# EAGLE design caphumidsens2_rev1_rc2 (EAGLE 6.3)
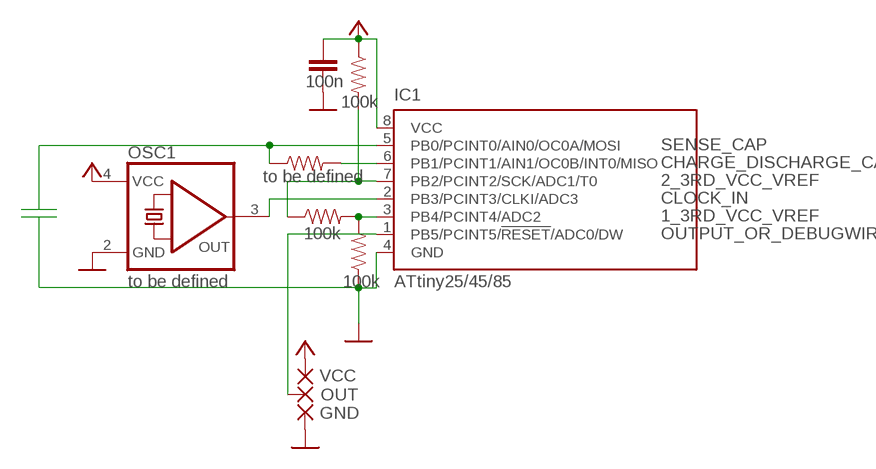
[diagram p0: schematic, sheet 1]

## Parts
C1  100n  CAP0805  [0805]
GND  WIREPADSMD2,54-5,08  SMD2  [SMD1,27-2,54]
IC1  ATtiny25/45/85  TINY13V-10SSU  [8S1]
OSC1  to be defined  XO32-OSCILLATOR  [XO32]
OUT  WIREPADSMD2,54-5,08  SMD2  [SMD1,27-2,54]
R1  100k  RESISTOR0805-RES  [0805]
R2  100k  RESISTOR0805-RES  [0805]
R3  100k  RESISTOR0805-RES  [0805]
R4  to be defined  RESISTOR0805-RES  [0805]
VCC  WIREPADSMD2,54-5,08  SMD2  [SMD1,27-2,54]

## Nets
1_3RD_VCC_VREF: IC1.3(PB4/PCINT4/ADC2) R2.2 R3.2
2_3RD_VCC_VREF: IC1.7(PB2/PCINT2/SCK/ADC1/T0) R1.2 R2.1
CHARGE_DISCHARGE_CAP: IC1.6(PB1/PCINT1/AIN1/OC0B/INT0/MISO) R4.2
CLOCK_IN: IC1.2(PB3/PCINT3/CLKI/ADC3) OSC1.3(OUT)
GND: C1.1 GND.1(P) IC1.4(GND) OSC1.2(GND) R3.1
OUTPUT_OR_DEBUGWIRE: IC1.1(PB5/PCINT5/!RESET!/ADC0/DW) OUT.1(P)
SENSE_CAP: IC1.5(PB0/PCINT0/AIN0/OC0A/MOSI) R4.1
VCC: C1.2 IC1.8(VCC) OSC1.4(VCC) R1.1 VCC.1(P)

## Library data of the parts
C1 = SparkFun:CAP: Capacitor Standard 0603 ceramic capacitor, and 0.1" leaded capacitor.
GND OUT VCC = wirepad:SMD2: SMD PAD
IC1 = atmel:TINY13: 8-bit AVR Microcontroller with 1K Bytes In-System Programmable Flash Source: http://www.atmel.com/dyn/resources/prod_documents/2535S.pdf; MPN: ATTINY13V-10SSU; OC_FARNELL: 1455135; OC_NEWARK: 58M3773
OSC1 = seb:XO32-OSCILLATOR
R1-R4 = SparkFun:RESISTOR: Resistor Basic schematic elements and footprints for 0603, 1206, and PTH resistors.

## Board
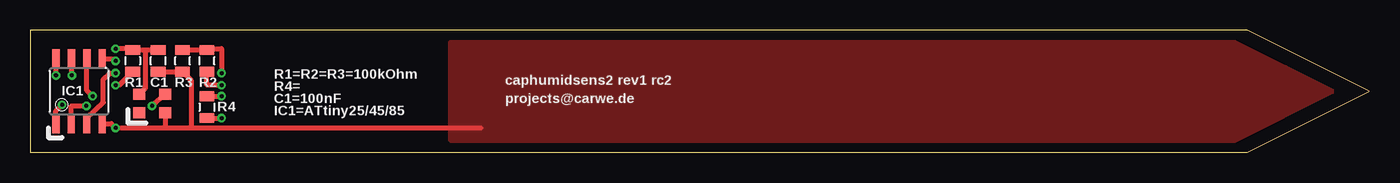
[diagram p1: board, top side]
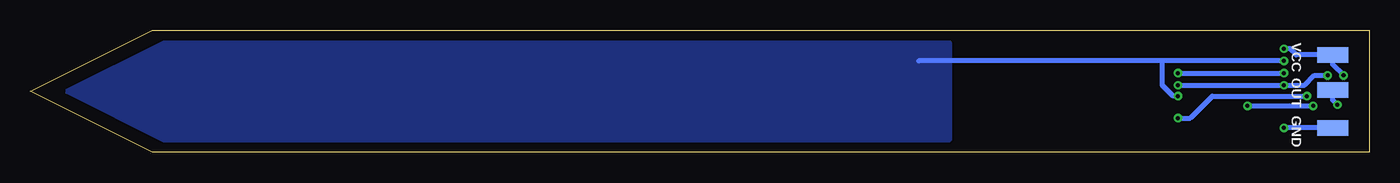
[diagram p2: board, bottom side, seen from below]

Size 110 x 10 mm. Coordinates in mm from the lower left corner, seen from the top.
Outline: 0,0 100,0 110,5 100,10 0,10 0,0
Copper layers (1*16): Top 0.0356mm / dielectric 1.5011mm / Bottom 0.0356mm
Design rules "OSHpark": minimum track width 6mil, minimum drill 13mil, track to track 6mil, track to pad 6mil, pad to pad 6mil, via to via 6mil, smd to smd 6mil, copper to edge 15mil, drill to drill 6mil, minimum pad ring 7mil, minimum via ring 7mil, stop-mask expansion 4mil, vias tented up to drill 0mil, thermal gap 10mil

### Footprints (pad centres in the part's own frame; a part is rotated, then mirrored left to right if it is on the bottom)
0805 = smd 0.8 x 1.2: 1 -0.9,0; 2 0.9,0
SMD1,27-2,54 = smd 1.27 x 2.54: 1 0,0
8S1 = smd 0.6 x 1.6: 1 -1.905,-2.654; 2 -0.645,-2.654; 3 0.625,-2.654; 4 1.895,-2.654; 5 1.905,2.654; 6 0.635,2.654; 7 -0.635,2.654; 8 -1.905,2.654
XO32 = smd 1 x 0.9: 1 1.075,0.775; 2 -1.075,0.775; 3 -1.075,-0.775; 4 1.075,-0.775

### Placement (x,y rotation side)
C1  10.5,7.5 90 top
GND  3,2 90 bottom
IC1  4,5 0 top
OSC1  10,4 180 top
OUT  3,5.1 90 bottom
R1  8.4,7.5 270 top
R2  14.5,7.5 90 top
R3  12.5,7.5 90 top
R4  14.5,3.7 270 top
VCC  3,8 90 bottom

### Tracks (layer width: path | path; a pad name or v marks a point on that pad's centre or on a via)
1_3RD_VCC_VREF  (via drill 0.33)
  Top 0.406: R3.2 R2.2 14.1,8.5 15.7,8.5 v15.7,6.5 | IC1.3 4.62,2.83 6,4.1 6,6 6.5,6.5 v7,6.5
  Bottom 0.406: v15.7,6.5 v7,6.5
2_3RD_VCC_VREF  (via drill 0.33)
  Top 0.406: IC1.7 3.37,6.57 v3.4,6.3 | R1.2 7.3,5.5 v7,5.5 | v15.7,5.5 14.5,5.5 R2.1
  Bottom 0.406: v15.7,5.5 v7,5.5 5.3,5.5 4.5,6.3 v3.4,6.3
CHARGE_DISCHARGE_CAP  (via drill 0.33)
  Top 0.406: v5.1,4.6 4.63,5.07 IC1.6 | R4.2 v15.7,2.8
  Bottom 0.406: v5.1,4.6 12.9,4.6 14.7,2.8 v15.7,2.8
CLOCK_IN  (via drill 0.33)
  Top 0.406: IC1.2 3.35,3.8 v4.6,3.8 | OSC1.3 v10,3.8
  Bottom 0.406: v10,3.8 v4.6,3.8
GND  (via drill 0.33)
  Top 0.406: C1.1 R3.1 13.2,5.9 13.2,2 | 13.2,2 37,2 | IC1.4 6.65,2.35 v7,2 11,2 | 11,2 13.2,2 | OSC1.2 11.07,2.08 11,2
  Bottom 0.406: GND.1 v7,2
  pour Top: 34.5,9 34.5,1 99,1 107,5 99,9
OUTPUT_OR_DEBUGWIRE  (via drill 0.33)
  Top 0.406: IC1.1 2.1,3.4 v2.6,3.9
  Bottom 0.406: v2.6,3.9 3,4.3 OUT.1
SENSE_CAP  (via drill 0.33)
  Top 0.406: IC1.5 6.85,7.65 v7,7.5 | R4.1 v15.7,4.6
  Bottom 0.406: v7,7.5 17,7.5 | 17,7.5 37,7.5 | v15.7,4.6 16.1,4.6 17,5.5 17,7.5
  pour Bottom: 34.5,9 34.5,1 99,1 107,5 99,9
VCC  (via drill 0.33)
  Top 0.406: IC1.8 2.1,6.59 v2.1,6.3 | 9.45,8.4 R1.1 7.9,8.5 v7,8.5 | 9.45,8.4 C1.2 | 9.45,8.4 9.45,5.25 OSC1.4
  Bottom 0.406: v2.1,6.3 3,7.2 VCC.1 6,8 6.5,8.5 v7,8.5

### Text on the board
tNames: R1=R2=R3=100kOhm | caphumidsens2 rev1 rc2 | R4= | C1=100nF | projects@carwe.de | IC1=ATtiny25/45/85